# Altium schematic sheet MAX17502.SchDoc
size A; SheetNumber: 6
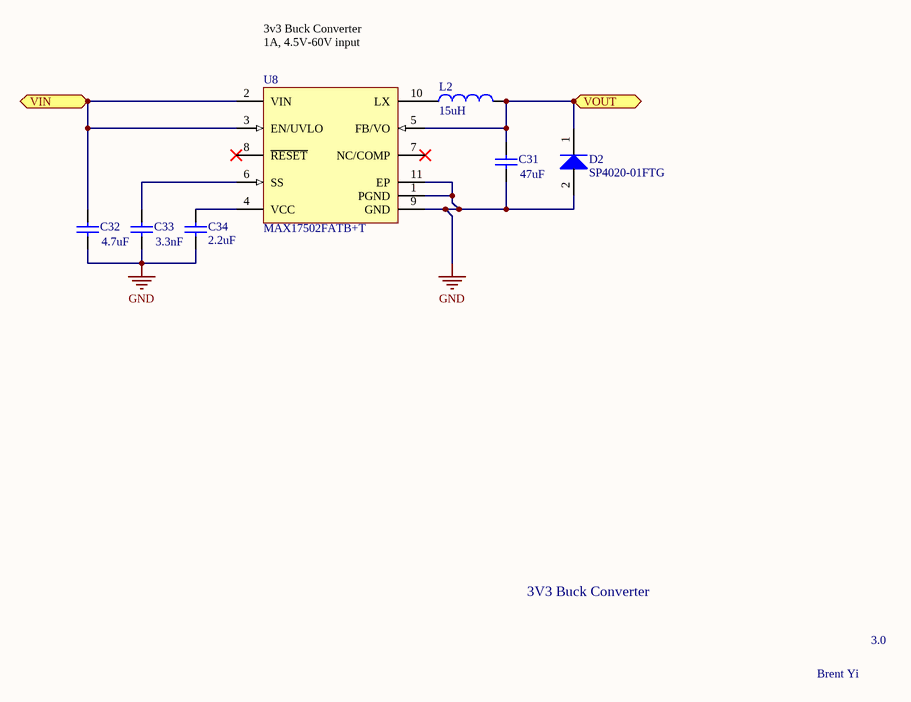
[diagram p0: MAX17502.SchDoc]

## Parts
C31  value 47uF  [CAPC1210(3225)280_L]
C32  value 4.7uF  [CAPC1210(3225)280_L]
C33  value 3.3nF  [CAPC0603(1608)55_L]
C34  value 2.2uF  [CAPC0603(1608)100_L]
D2  SP4020-01FTG  [SOD323]
L2  value 15uH  [SDR0604]  (hidden comment: SDR0805-180ML)
U8  MAX17502FATB+T  [MAXM-T1032N+1_V]

## Ports
VIN, VOUT

## Nets
GND: C31.1 C32.1 C33.2 C34.2 D2.2(A) U8.1(PGND) U8.9(GND) U8.11(EP)
VIN: C32.2 U8.2(VIN) U8.3(EN/UVLO) ; port VIN
VOUT: C31.2 D2.1(K) L2.2 U8.5(FB/VO) ; port VOUT
NetC33_1: C33.1 U8.6(SS)
NetC34_1: C34.1 U8.4(VCC)
NetL2_1: L2.1 U8.10(LX)

Not connected (* = marked no-connect by the designer): U8 7(NC/COMP)* 8(~{RESET})*

## Notes on the sheet
- 3v3 Buck Converter
  1A, 4.5V-60V input
- 3V3 Buck Converter
- 3.0
- Brent Yi

## Library data of the parts
C31 C32 = CMP-1038-02301-1: CAP 100uF 10V Â±10% 1210 (3225 Metric) Thickness 2.8mm SMD; Case-EIA: 1210; Case-Metric: 3225; Rated Voltage: 6.3 V; Tolerance: Â±10%; Technology: SMT; Max Thickness: 2.8 mm
C33 = CMP-1035-02762-1: CAP 2.2uF 16V Â±10% 0603 (1608 Metric) Thickness 0.55mm SMD; Rated Voltage: 50V; Case-EIA: 0603; Case-Metric: 1608; Max Thickness: 0.55 mm; Technology: SMT; Tolerance: Â±10%
C34 = CMP-1035-02730-1: CAP 1uF 6.3V Â±10% 0603 (1608 Metric) Thickness 1mm SMD; Case-EIA: 0603; Rated Voltage: 50V; Case-Metric: 1608; Max Thickness: 1 mm; Technology: SMT; Tolerance: Â±10%
D2 = SP4020-01FTG: PartNumber: MMSZ5262BT1G; Manufacturer: On Semiconductor; P Max (W): 0.5; Packing: Tape and Reel; VZ Typ (V): 51; PackageVersion: Rev. G, 10/2009; ComponentLink3Description: Package Specification; PackageReference: SOD-123-2-425-04; PackageDescription: 2-Pin SOD, Body 1.6 x 2.69 mm; ComponentLink1Description: Manufacturer URL; ComponentLink2Description: Datasheet; DatasheetVersion: Rev. 12; Mounting Technology: Surface Mount; RoHS: Pb-Free; ComponentLink1URL: http://www.onsemi.com/; ComponentLink3URL: http://www.onsemi.com/pub_link/Collateral/425-04.PDF; ComponentLink2URL: http://www.onsemi.com/pub_link/Collateral/MMSZ5221BT1-D.PDF
L2 = SDR0805-180ML: Inductor; Code_IEC: 1005; Published: 8-Jun-2000; LatestRevisionDate: 29-May-2009; LatestRevisionNote: IPC-7351 Footprint Added.; PackageReference: 0402-A; Publisher: Altium Limited; PackageDescription: Chip Inductor; Code_JEITA: 0402
U8 = CMP-1264-00001-1: Ultra-Small, High-Efficiency, Synchronous Step-Down DC-DC Converter, 4.5 to 60 V, 1 A, -40 to 125 degC, 10-Pin TDFN (T1032N+1), RoHS, Tape and Reel; Manufacturer: Maxim; FSW: 600 KHz Typ.; DC-DC Outputs: 1; VOUT: 5 V; IEN: 8 nA Typ.; IOUT: 1 A Max.; VCC: 4.65 to 5.35 V; PackageVersion: Rev. C; VIN: 4.5 to 60 V; Operating Temperature Range: -40 to 125 degC; PartNumber: MAX17502FATB+T; Packing: Tape and Reel; DatasheetVersion: Rev. 2; RoHS: TRUE; ComponentLink1Description: Manufacturer URL; PackageDescription: 10-Pin TDFN, Body 3 x 2 mm, Pitch 0.5 mm; ComponentLink2URL: http://datasheets.maximintegrated.com/en/ds/MAX17502.pdf; ComponentLink3Description: Package Specification; ComponentLink3URL: http://pdfserv.maximintegrated.com/package_dwgs/21-0429.PDF; Mounting Technology: Surface Mount; ComponentLink2Description: Datasheet; ComponentLink1URL: http://www.maximintegrated.com/en.html